# EAGLE design Eggs_Control (EAGLE 6.4)

## Sheet 1 of 2
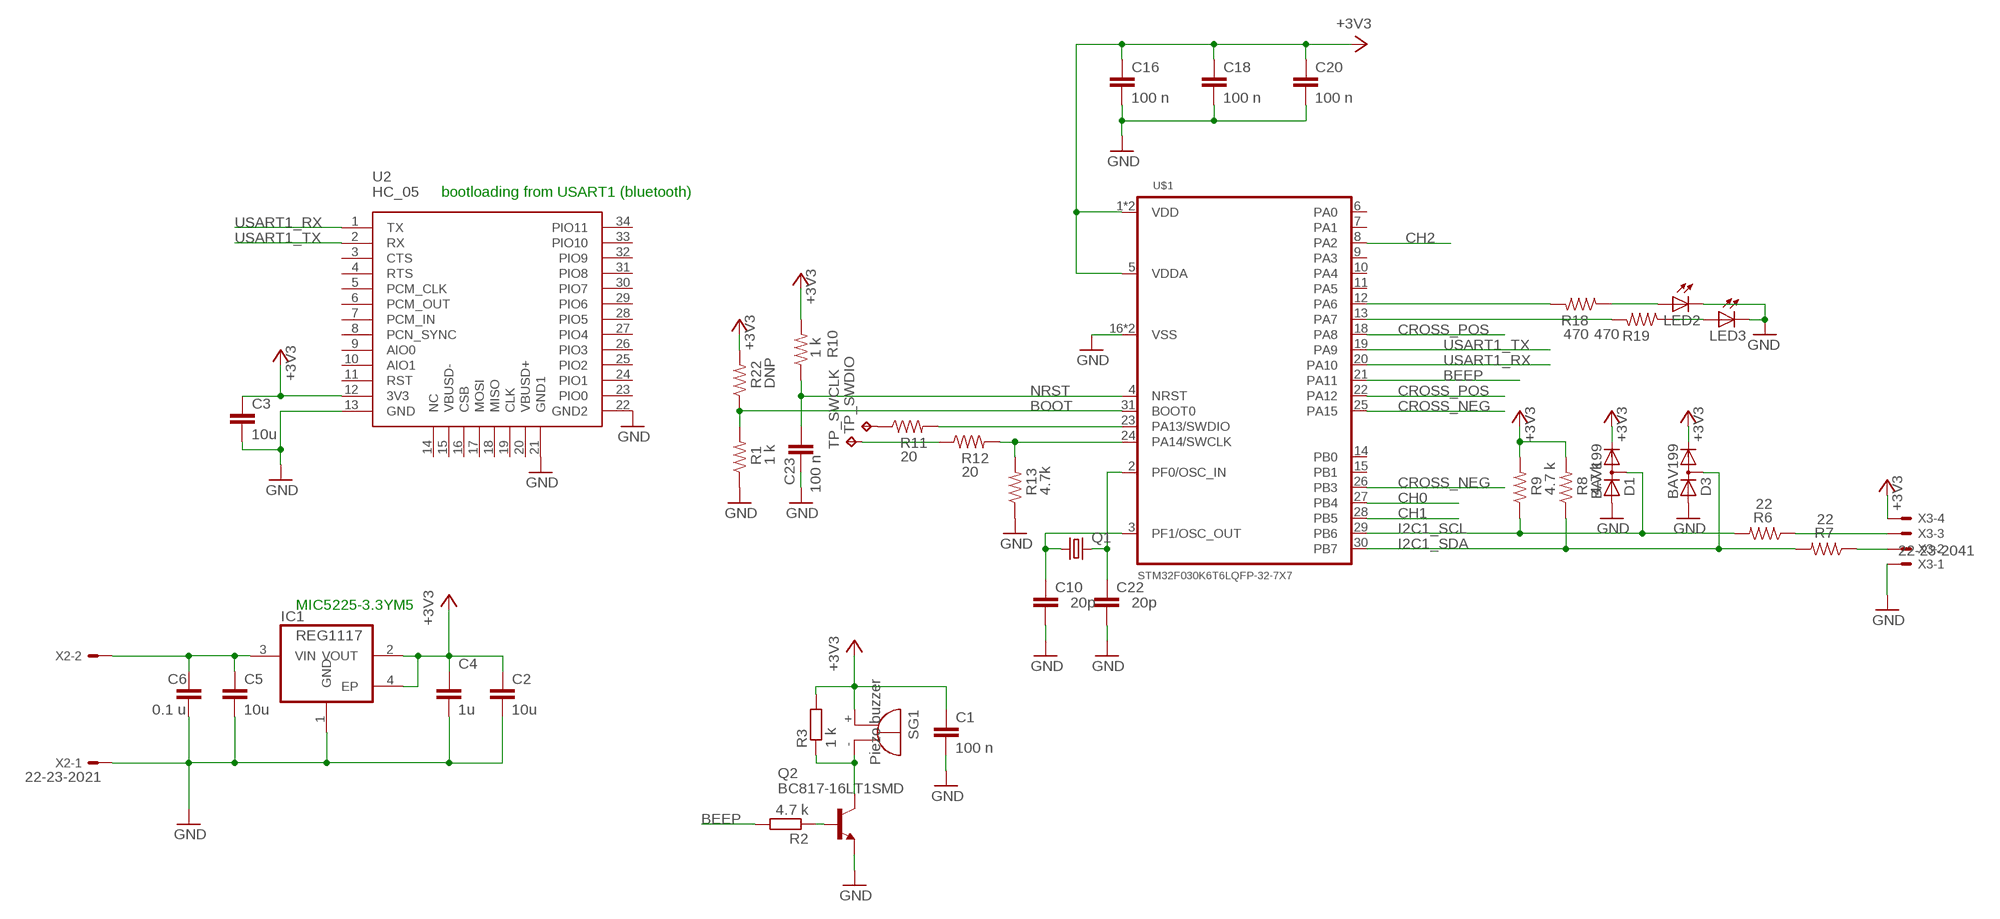
[diagram p0: schematic, sheet 1]

### Parts
C1  100 n  C-EUC0603  [C0603]
C2  10u  C-EUC0805  [C0805]
C3  10u  C-EUC0805  [C0805]
C4  1u  C-EUC0603  [C0603]
C5  10u  C-EUC0805  [C0805]
C6  0.1 u  C-EUC0603  [C0603]
C10  20p  C-EUC0603  [C0603]
C16  100 n  C-EUC0603  [C0603]
C18  100 n  C-EUC0603  [C0603]
C20  100 n  C-EUC0603  [C0603]
C22  20p  C-EUC0603  [C0603]
C23  100 n  C-EUC0603  [C0603]
D1  BAV199  [SOT23]
D3  BAV199  [SOT23]
IC1  REG1117  [SOT223]
LED2  LED_ESML0603  [LED_SML0603]
LED3  LED_ESML0603  [LED_SML0603]
Q1  CRYSTALSM49  [SM49]
Q2  BC817-16LT1SMD  [SOT23-BEC]
R1  1 k  R-US_R0603  [R0603]
R2  4.7 k  R-EU_R0603  [R0603]
R3  1 k  R-EU_R0603  [R0603]
R6  22  R-US_R0603  [R0603]
R7  22  R-US_R0603  [R0603]
R8  4.7 k  R-US_R0603  [R0603]
R9  4.7 k  R-US_R0603  [R0603]
R10  1 k  R-US_R0603  [R0603]
R11  20  R-US_R0603  [R0603]
R12  20  R-US_R0603  [R0603]
R13  4.7k  R-US_R0603  [R0603]
R18  470  R-US_R0603  [R0603]
R19  470  R-US_R0603  [R0603]
R22  DNP  R-US_R0603  [R0603]
SG1  Piezo buzzer  F/HMB  [F/HMB]
TP_SWCLK  TPTP10SQ  [TP10SQ]
TP_SWDIO  TPTP10SQ  [TP10SQ]
U2  HC_05  [BLUETOOTH_SMD]
U$1  STM32F030K6T6LQFP-32-7X7  [LQFP32-7X7]
X2  22-23-2021  [22-23-2021]
X3  22-23-2041  [22-23-2041]

### Nets
+3V3: C1.1 C2.1 C3.1 C4.1 C16.1 C18.1 C20.1 D1.2(C) D3.2(C) IC1.2(VOUT) IC1.4(EP) R3.2 R8.2 R9.2 R10.2 R22.2 SG1.+ U2.12(3V3) U$1.1(VDD) U$1.5(VDDA) U$1.17(VDD) X3.4 ; also sheet 2
BEEP: R2.2 U$1.21(PA11)
BOOT: R1.2 R22.1 U$1.31(BOOT0)
CH0: U$1.27(PB4) ; also sheet 2
CH1: U$1.28(PB5) ; also sheet 2
CH2: U$1.8(PA2) ; also sheet 2
CROSS_NEG: U$1.25(PA15) U$1.26(PB3) ; also sheet 2
CROSS_POS: U$1.18(PA8) U$1.22(PA12) ; also sheet 2
GND: C1.2 C2.2 C3.2 C4.2 C5.2 C6.2 C10.2 C16.2 C18.2 C20.2 C22.2 C23.2 D1.1(A) D3.1(A) IC1.1(GND) LED2.C LED3.C Q2.E R1.1 R13.1 U2.13(GND) U2.21(GND1) U2.22(GND2) U$1.16(VSS) U$1.32(VSS) X2.1 X3.1 ; also sheet 2
I2C1_SCL: D1.3(AC) R6.2 R9.1 U$1.29(PB6)
I2C1_SDA: D3.3(AC) R7.2 R8.1 U$1.30(PB7)
N$2: Q2.B R2.1
N$4: Q2.C R3.1 SG1.-
N$6: R18.2 U$1.12(PA6)
N$8: R19.2 U$1.13(PA7)
N$11: R7.1 X3.2
N$12: R6.1 X3.3
N$17: LED2.A R18.1
N$18: LED3.A R19.1
N$21: R11.2 U$1.23(PA13/SWDIO)
N$22: R12.2 R13.2 U$1.24(PA14/SWCLK)
N$24: R11.1 TP_SWDIO.TP
N$25: R12.1 TP_SWCLK.TP
N$29: C5.1 C6.1 IC1.3(VIN) X2.2
N$34: C22.1 Q1.2 U$1.2(PF0/OSC_IN)
N$35: C10.1 Q1.1 U$1.3(PF1/OSC_OUT)
NRST: C23.1 R10.1 U$1.4(NRST)
USART1_RX: U2.1(TX) U$1.20(PA10)
USART1_TX: U2.2(RX) U$1.19(PA9)
Unconnected: U2.3(CTS) U2.4(RTS) U2.5(PCM_CLK) U2.6(PCM_OUT) U2.7(PCM_IN) U2.8(PCN_SYNC) U2.9(AIO0) U2.10(AIO1) U2.11(RST) U2.14(NC) U2.15(VBUSD-) U2.16(CSB) U2.17(MOSI) U2.18(MISO) U2.19(CLK) U2.20(VBUSD+) U2.23(PIO0) U2.24(PIO1) U2.25(PIO2) U2.26(PIO3) U2.27(PIO4) U2.28(PIO5) U2.29(PIO6) U2.30(PIO7) U2.31(PIO8) U2.32(PIO9) U2.33(PIO10) U2.34(PIO11) U$1.6(PA0) U$1.7(PA1) U$1.9(PA3) U$1.10(PA4) U$1.11(PA5) U$1.14(PB0) U$1.15(PB1)

### Notes on the sheet
- bootloading from USART1 (bluetooth)
- MIC5225-3.3YM5

## Sheet 2 of 2
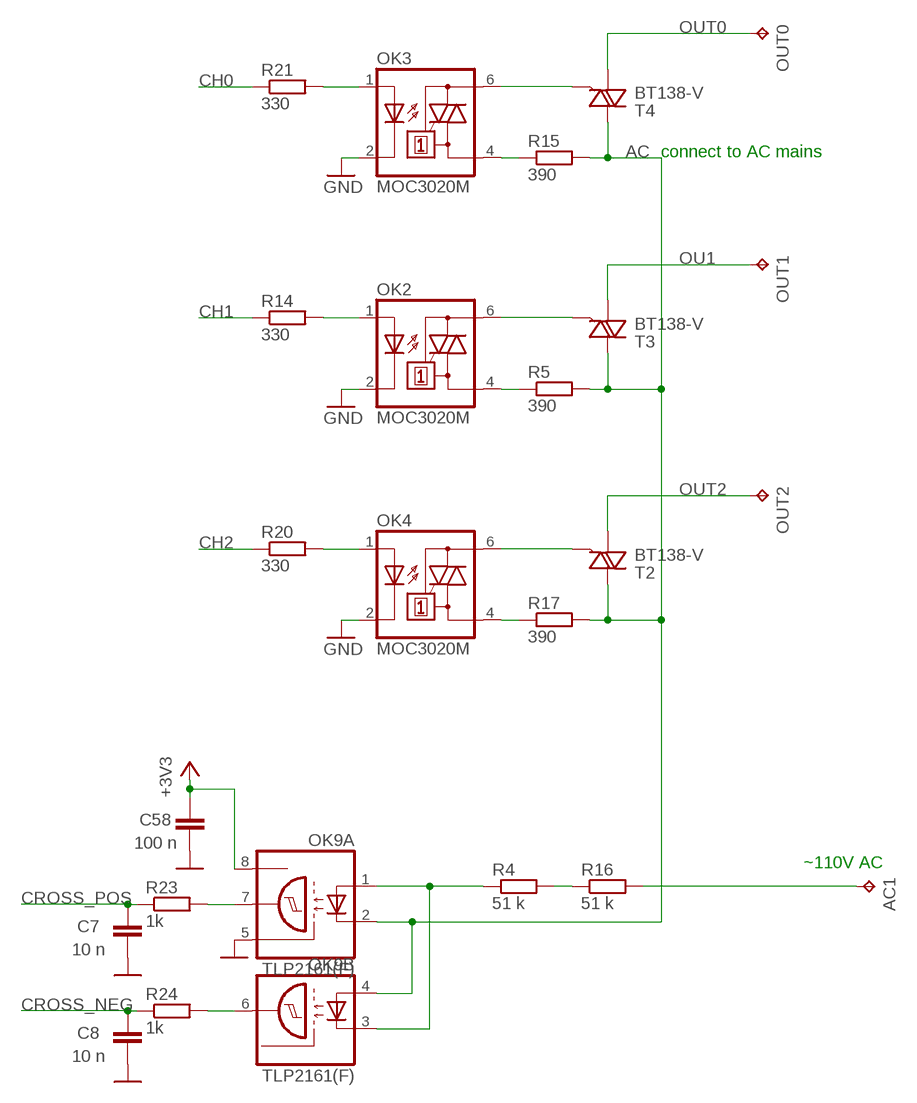
[diagram p1: schematic, sheet 2]

### Parts
AC1  TPPAD1-17  [P1-17]
C7  10 n  C-EUC0603  [C0603]
C8  10 n  C-EUC0603  [C0603]
C58  100 n  C-EUC0603  [C0603]
OK2  MOC3020M  [DIL06]
OK3  MOC3020M  [DIL06]
OK4  MOC3020M  [DIL06]
OK9  TLP2161(F)  [SOIC08-FAIRCHILD]
OUT0  TPPAD1-17  [P1-17]
OUT1  TPPAD1-17  [P1-17]
OUT2  TPPAD1-17  [P1-17]
R4  51 k  R-EU_R1206  [R1206]
R5  390  R-EU_R0603  [R0603]
R14  330  R-EU_R0603  [R0603]
R15  390  R-EU_R0603  [R0603]
R16  51 k  R-EU_R1206  [R1206]
R17  390  R-EU_R0603  [R0603]
R20  330  R-EU_R0603  [R0603]
R21  330  R-EU_R0603  [R0603]
R23  1k  R-EU_R0603  [R0603]
R24  1k  R-EU_R0603  [R0603]
T2  BT138-V  [TO220BV]
T3  BT138-V  [TO220BV]
T4  BT138-V  [TO220BV]

### Nets
+3V3: C58.1 OK9.8(A:VCC) ; also sheet 1
AC: OK9.2(A:C) OK9.4(B:A) R5.2 R15.2 R17.2 T2.T2(A2) T3.T2(A2) T4.T2(A2)
CH0: R21.1 ; also sheet 1
CH1: R14.1 ; also sheet 1
CH2: R20.1 ; also sheet 1
CROSS_NEG: C8.1 R24.1 ; also sheet 1
CROSS_POS: C7.1 R23.1 ; also sheet 1
GND: C7.2 C8.2 C58.2 OK2.2(C) OK3.2(C) OK4.2(C) OK9.5(A:GND) ; also sheet 1
N$1: OK9.1(A:A) OK9.3(B:C) R4.1
N$3: AC1.TP R16.2
N$5: OK9.7(A:OUT) R23.2
N$7: OK9.6(B:OUT) R24.2
N$20: OK2.1(A) R14.2
N$36: R4.2 R16.1
N$37: OK4.1(A) R20.2
N$42: OK4.4(A1) R17.1
N$44: OK4.6(A2) T2.G
N$46: OK2.4(A1) R5.1
N$48: OK2.6(A2) T3.G
N$52: OK3.1(A) R21.2
N$54: OK3.4(A1) R15.1
N$56: OK3.6(A2) T4.G
OU1: OUT1.TP T3.T1(A1)
OUT0: OUT0.TP T4.T1(A1)
OUT2: OUT2.TP T2.T1(A1)

### Notes on the sheet
- connect to AC mains
- ~110V AC

## Library data of the parts
AC1 OUT0 OUT1 OUT2 TP_SWCLK TP_SWDIO = testpad:TP: Test pad
C1-C8 C10 C16 C18 C20 C22 C23 C58 = rcl:C-EU: CAPACITOR, European symbol
D1 D3 = diode:BAV199: DIODE low-leakage double diode
IC1 = burr-brown:REG1117: 800mA and 1A Low Dropout (LDO) Positive Regulator 1.8V, 2.5V, 2.85V, 3.3V, 5V, and Adj; MPN: REG1117; OC_FARNELL: 1097566; OC_NEWARK: 14P6981
LED2 LED3 = eagle-ltspice:LED_E: LED Source: http://www.osram.convergy.de Source: www.luxeon.com Source: www.kingbright.com; SPICEMODEL: NONE; SPICEPREFIX: D; SPICETYPE: diode
OK2-OK4 = optocoupler:MOC30*M: RANDOM-PHASE OPTOISOLATORS TRIAC DRIVER OUTPUT Source: http://www.fairchildsemi.com MOC3020-M.pdf; MF: FAIRCHILD SEMICONDUCTOR; MPN: MOC3020-M; OC_FARNELL: 1505425; OC_NEWARK: 72K8895
OK9 = optocoupler:TLP2161(F)
Q1 = adafruit:CRYSTAL: CRYSTAL; OC_FARNELL: unknown; OC_NEWARK: unknown
Q2 = transistor-npn:BC817*: NPN Transistor
R1 R6-R13 R18 R19 R22 = resistor:R-US_: RESISTOR, American symbol
R2-R4 R16 = resistor:R-EU_: RESISTOR, European symbol
R5 R14 R15 R17 R20 R21 R23 R24 = rcl:R-EU_: RESISTOR, European symbol
SG1 = buzzer:F/HMB: BUZZER Source: Buerklin; OC_FARNELL: unknown; OC_NEWARK: unknown
T2-T4 = triac:BT138: TRIAC Source: http://www.semiconductors.philips.com BT138_SERIES_2.pdf
U2 = Bluetooth HC-05:HC_05: HC-05 Bluetooth Module
U$1 = STM32F030K6T6:STM32F030K6T6
X2 = con-molex:22-23-2021: .100" (2.54mm) Center Header - 2 Pin; MF: MOLEX; MPN: 22-23-2021; OC_FARNELL: 1462926; OC_NEWARK: 25C3832
X3 = con-molex:22-23-2041: .100" (2.54mm) Center Header - 4 Pin; MF: MOLEX; MPN: 22-23-2041; OC_FARNELL: 1462920; OC_NEWARK: 38C0355

## Net classes
1 PWR: width 0.203 mm, drill 0.4 mm, clearance 0.076 mm

## Board
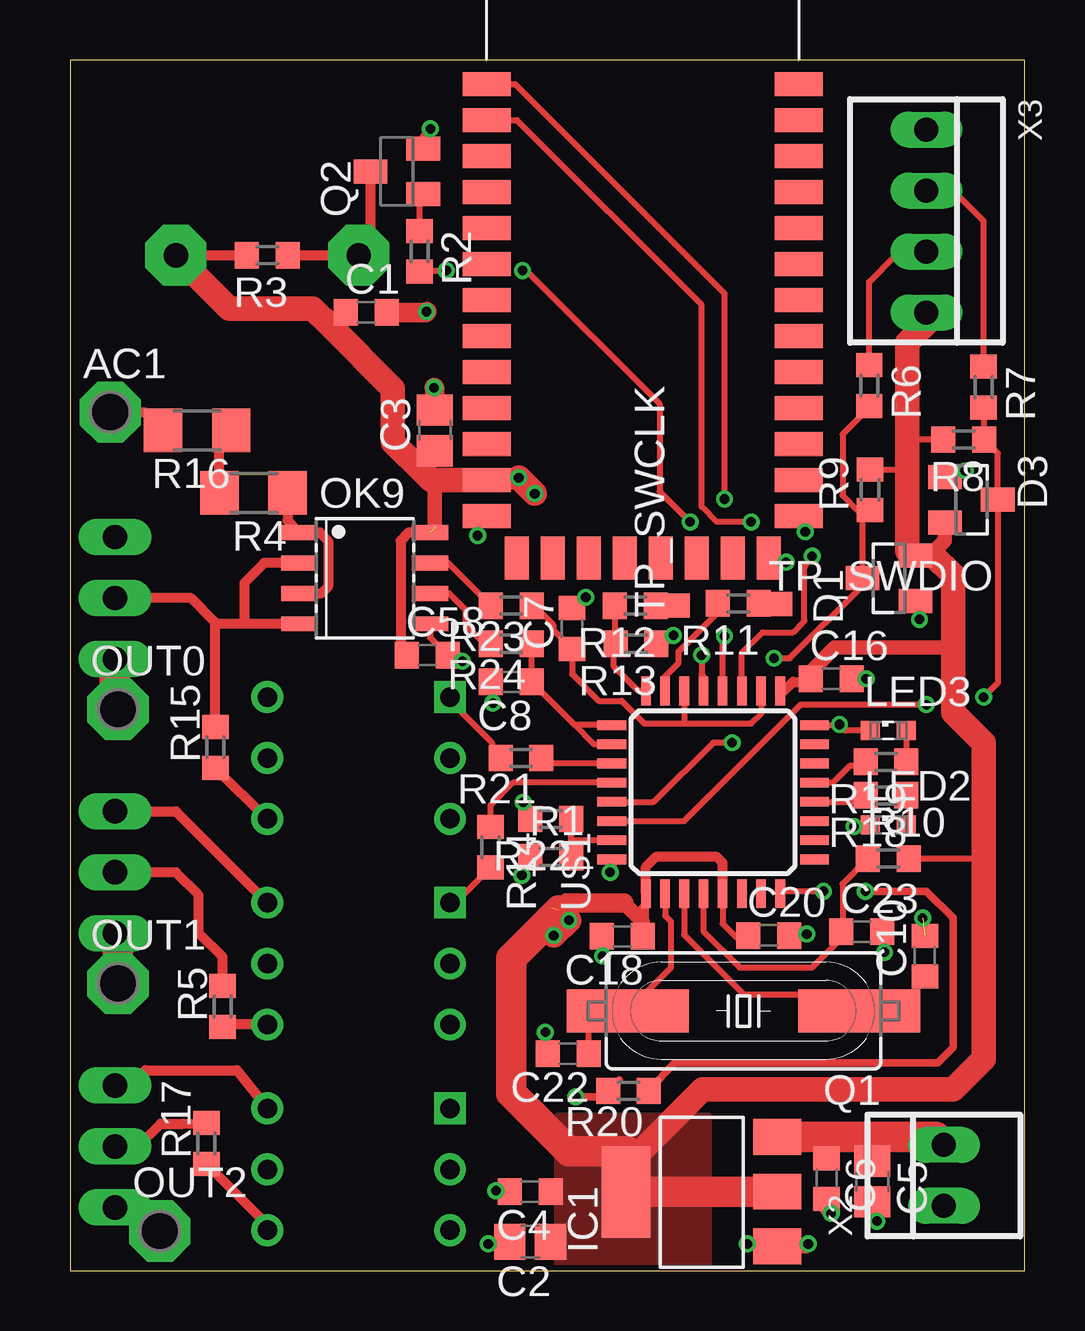
[diagram p2: board, top side]
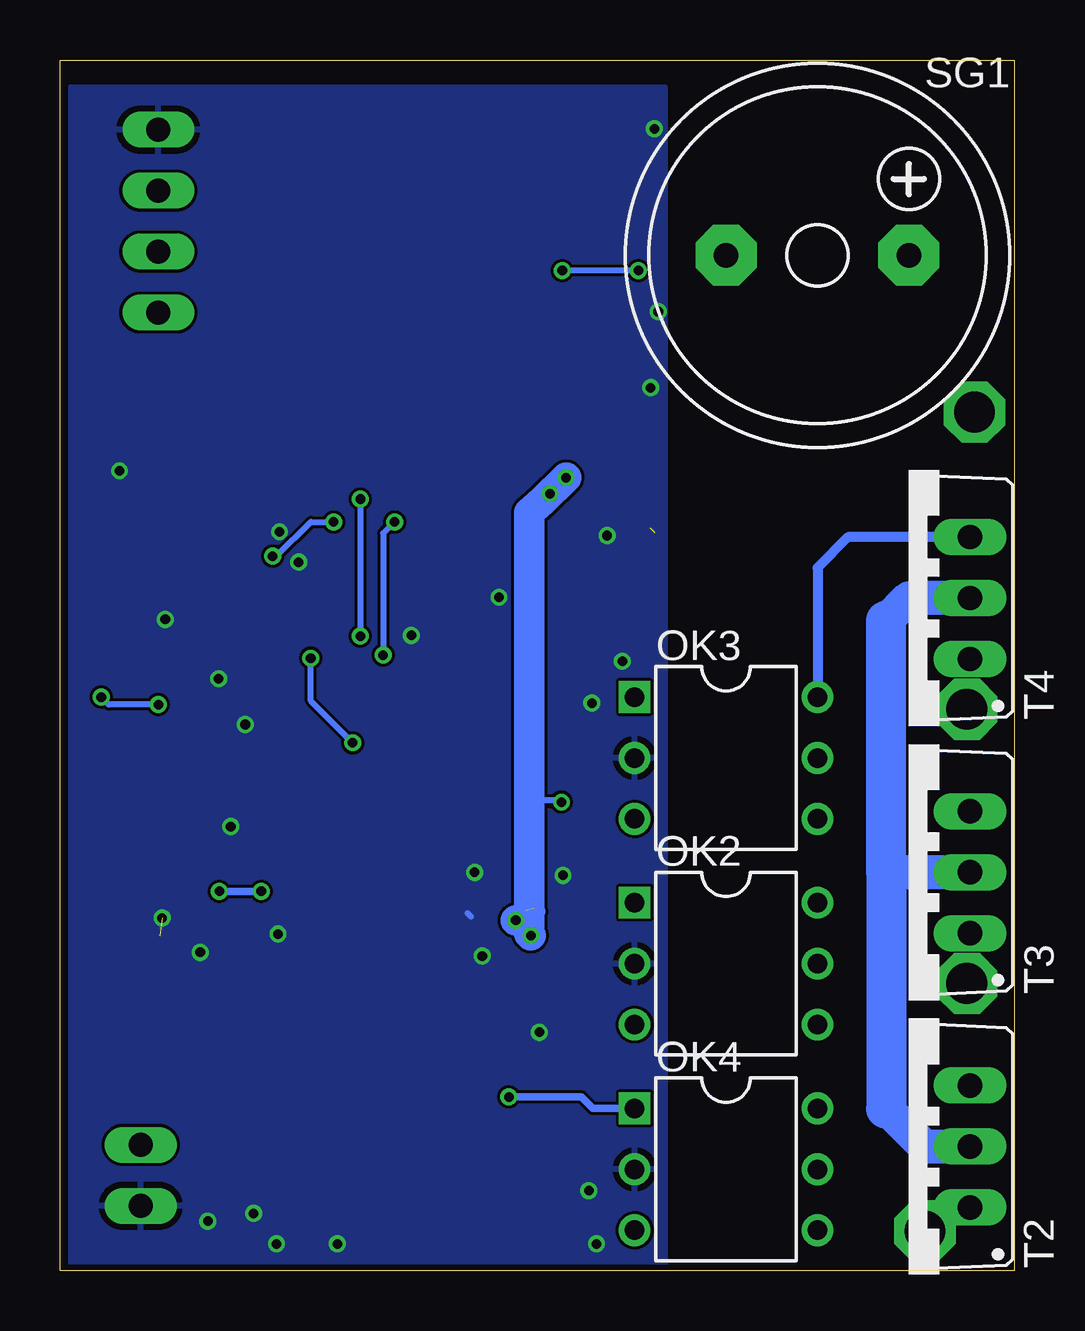
[diagram p3: board, bottom side, seen from below]

Size 39.77 x 50.48 mm. Coordinates in mm from the lower left corner, seen from the top.
Outline: 0,0 39.77,0 39.77,50.48 0,50.48 0,0
Copper layers (1*16): Top 0.035mm / dielectric 1.5mm / Bottom 0.035mm
Design rules "dirt_cheap_dirty_boards.v1": minimum track width 5mil, minimum drill 12mil, track to track 5mil, track to pad 5mil, pad to pad 5mil, via to via 5mil, smd to smd 0mil, copper to edge 10mil, drill to drill 10mil, minimum pad ring 10mil, minimum via ring 6mil, stop-mask expansion 2mil, vias tented up to drill 25mil, thermal gap 10mil

### Footprints (pad centres in the part's own frame; a part is rotated, then mirrored left to right if it is on the bottom)
P1-17 = drill 1.702 pad 2.54 octagon: TP 0,0
C0603 = smd 1 x 1.1: 1 -0.85,0; 2 0.85,0
C0805 = smd 1.3 x 1.5: 1 -0.85,0; 2 0.85,0
SOT23 = smd 1 x 1.4: 1 -0.95,-1.1; 2 0.95,-1.1; 3 0,1.1
SOT223 = smd 1.499 x 2.007: 1 -2.261,-3.15; 2 0.025,-3.15; 3 2.311,-3.15 | smd 3.81 x 2.007: 4 0,3.15
LED_SML0603 = smd 0.8 x 0.8: A 0.75,0; C -0.75,0
DIL06 = drill 0.813 square: 1 -2.54,-3.81 | drill 0.813: 2 0,-3.81; 3 2.54,-3.81; 4 2.54,3.81; 5 0,3.81; 6 -2.54,3.81
SOIC08-FAIRCHILD = smd 0.61 x 1.52: 1 -1.905,-2.723; 2 -0.635,-2.723; 3 0.635,-2.723; 4 1.905,-2.723; 5 1.905,2.723; 6 0.635,2.723; 7 -0.635,2.723; 8 -1.905,2.723
SM49 = smd 5.08 x 1.778: 1 -4.826,0; 2 4.826,0
SOT23-BEC = smd 1 x 1.4: B -0.95,-1.1; C 0,1.1; E 0.95,-1.1
R0603 = smd 1 x 1.1: 1 -0.85,0; 2 0.85,0
R1206 = smd 1.6 x 1.803: 1 -1.422,0; 2 1.422,0
F/HMB = drill 1.016 pad 2.54 octagon: + 3.81,0; - -3.81,0
TO220BV = drill 1.016 long: G 2.54,-2.54; T1 -2.54,-2.54; T2 0,-2.54
TP10SQ = smd 1 x 1: TP 0,0
BLUETOOTH_SMD = smd 2 x 1: 1 -6.35,3.81; 2 -6.35,2.31; 3 -6.35,0.81; 4 -6.35,-0.69; 5 -6.35,-2.19; 6 -6.35,-3.69; 7 -6.35,-5.19; 8 -6.35,-6.69; 9 -6.35,-8.19; 10 -6.35,-9.69; 11 -6.35,-11.19; 12 -6.35,-12.69; 13 -6.35,-14.19; 22 6.65,-14.19; 23 6.65,-12.69; 24 6.65,-11.19; 25 6.65,-9.69; 26 6.65,-8.19; 27 6.65,-6.69; 28 6.65,-5.19; 29 6.65,-3.69; 30 6.65,-2.19; 31 6.65,-0.69; 32 6.65,0.81; 33 6.65,2.31; 34 6.65,3.81 | smd 1 x 1.8: 14 -5.1,-15.94; 15 -3.6,-15.94; 16 -2.1,-15.94; 17 -0.6,-15.94; 18 0.9,-15.94; 19 2.4,-15.94; 20 3.9,-15.94; 21 5.4,-15.94
LQFP32-7X7 = smd 1.2 x 0.4: 1 -4.225,2.8; 2 -4.225,2; 3 -4.225,1.2; 4 -4.225,0.4; 5 -4.225,-0.4; 6 -4.225,-1.2; 7 -4.225,-2; 8 -4.225,-2.8; 17 4.225,-2.8; 18 4.225,-2; 19 4.225,-1.2; 20 4.225,-0.4; 21 4.225,0.4; 22 4.225,1.2; 23 4.225,2; 24 4.225,2.8 | smd 0.4 x 1.2: 9 -2.8,-4.225; 10 -2,-4.225; 11 -1.2,-4.225; 12 -0.4,-4.225; 13 0.4,-4.225; 14 1.2,-4.225; 15 2,-4.225; 16 2.8,-4.225; 25 2.8,4.225; 26 2,4.225; 27 1.2,4.225; 28 0.4,4.225; 29 -0.4,4.225; 30 -1.2,4.225; 31 -2,4.225; 32 -2.8,4.225
22-23-2021 = drill 1 long: 1 -1.27,0; 2 1.27,0
22-23-2041 = drill 1 long: 1 -3.81,0; 2 -1.27,0; 3 1.27,0; 4 3.81,0

### Placement (x,y rotation side)
AC1  1.67,35.79 0 top
C1  12.34,39.95 0 top
C2  19.16,1.22 180 top
C3  15.19,35.03 90 top
C4  19.16,3.31 180 top
C5  33.42,3.73 270 top
C6  31.51,3.85 270 top
C7  20.91,26.78 90 top
C8  18.37,24.55 180 top
C10  35.61,13.12 90 top
C16  31.7,24.68 0 top
C18  23,13.95 180 top
C20  29.1,13.98 0 top
C22  20.75,9.06 180 top
C23  32.97,14.14 0 top
C58  14.88,25.67 0 top
D1  34.12,28.87 90 top
D3  37.54,32.14 270 top
IC1  26.3,3.28 90 top
LED2  34.08,18.59 0 top
LED3  34.08,22.52 0 top
OK2  12.02,12.81 270 bottom
OK3  12.02,21.38 270 bottom
OK4  12.02,4.23 270 bottom
OK9  12.27,28.87 270 top
OUT0  1.98,23.41 0 top
OUT1  1.98,11.98 0 top
OUT2  3.73,1.66 0 top
Q1  28.05,10.84 180 top
Q2  13.61,45.83 90 top
R1  20.02,17.25 0 top
R2  14.56,42.49 270 top
R3  8.21,42.34 180 top
R4  7.64,32.43 180 top
R5  6.34,11.03 90 top
R6  33.29,36.91 270 top
R7  38.05,36.84 270 top
R8  37.23,34.65 180 top
R9  33.32,32.56 90 top
R10  34.08,17.19 0 top
R11  27.83,27.83 180 top
R12  23.54,27.73 180 top
R13  23.57,26.14 180 top
R14  17.51,17.67 270 top
R15  6.05,21.82 90 top
R16  5.29,35.03 180 top
R17  5.67,5.31 90 top
R18  33.99,19.82 180 top
R19  33.99,21.22 180 top
R20  23.26,7.51 180 top
R21  18.78,21.38 180 top
R22  20.02,18.84 180 top
R23  18.37,27.73 180 top
R24  18.37,26.14 180 top
SG1  8.21,42.34 0 bottom
T2  4.4,5.19 90 bottom
T3  4.4,16.62 90 bottom
T4  4.4,28.05 90 bottom
TP_SWCLK  25.32,27.73 90 top
TP_SWDIO  29.58,27.79 0 top
U2  23.7,45.66 0 top
U$1  26.78,19.95 90 top
X2  36.4,3.98 90 top
X3  35.67,43.76 270 top

### Tracks (layer width: path | path; a pad name or v marks a point on that pad's centre or on a via)
+3V3  (via drill 0.4)  (2 unrouted)
  Top 0.254: 13.76,25.93 C58.1 | C1.1 11.38,39.95 10.83,39.4 | 15.19,34.08 15.19,33.6 14.8,33.21 | R8.2 34.94,34.65 34.88,34.71 | R9.2 34.68,33.41 34.88,33.6 | R22.2 19.17,19.25 v18.88,19.54 | U$1.1 23.98,14.08 C18.1 | U$1.5 27.18,14.47 27.73,13.92 28.34,13.92 C20.1 | R10.2 37.99,17.19 38.05,17.25
  Top 0.305: 37.99,16.71 38.05,16.78
  Top 0.406: SG1.+ R3.2 | 18.59,32.97 v18.69,33.06 | OK9.8 14.11,30.78 13.76,30.43 13.76,25.93 | U$1.17 29.74,24.18 30.11,24.55 30.73,24.55 C16.1 | U$1.1 23.98,16.83 24.4,17.25 26.94,17.25 27.18,17.01 U$1.5 | C18.1 23.85,14.55 23.85,15.1
  Top 0.61: 15.19,32.97 15.19,30.98 | 7.41,42.28 R3.2 | D3.2 36.44,30.44 35.83,29.82 | C16.1 30.85,24.98 31.86,25.98 36.78,25.98 | 23.06,15.35 23.85,14.55 | 20.69,15.35 20.37,15.03
  Top 0.813: 15.14,34.24 C3.1 15.19,34.08 | U2.12 18.59,32.97 | X3.4 35.67,39.48 | 34.88,30 D1.2 35.83,29.82 35.96,29.82 | 23.06,15.35 20.69,15.35
  Top 1.016: U2.12 15.19,32.97 15.03,32.97 14.8,33.21 13.45,34.56 13.45,36.78 10.83,39.4 10.11,40.11 6.62,40.11 SG1.+ | C3.1 | v18.69,33.06 v19.35,32.4 | v20.15,13.98 v20.78,14.62 | 23.18,4.39 26.36,7.57 36.78,7.57 38.05,8.84 38.05,16.78 38.05,17.25 38.05,22.02 36.78,23.29 36.78,25.98 36.78,29 35.96,29.82 | 35.67,39.48 34.88,38.68 34.88,34.71 34.88,33.6 34.88,30
  Top 1.27: IC1.2 23.18,3.31 | 23.18,3.31 IC1.4 | 23.18,3.31 23.18,4.39 23.18,4.98 20.8,4.98 18.37,7.41 18.37,13.03 20.37,15.03
  Bottom 0.254: 20.11,17.32 20.21,17.41 | 20.27,26.24 20.21,26.3 | 20.21,19 20.15,19.06 20.15,19.13 19.64,19.63 18.97,19.63 v18.88,19.54
  Bottom 0.305: 19.84,14.98 20,15.14
  Bottom 0.61: 20.27,14.62 20.21,14.62 19.84,14.98
  Bottom 1.27: 20.21,14.55 20.21,17.41 20.21,19 20.21,26.3 20.21,31.6 19.67,32.08 v18.69,33.06 | 20.21,14.55 20.21,14.05 v20.15,13.98 | v20.78,14.62 20.27,14.62 20.21,14.55
  pour Top (no thermals): 20.27,6.46 20.27,0.27 26.62,0.27 26.62,6.3 26.62,6.46 20.43,6.46
AC
  Top 0.406: T2.T2 2.81,5.19 3.76,6.14 4.69,6.14 R17.2 | R5.2 6.34,13.08 5.35,14.08 5.35,15.66 4.4,16.62 T3.T2 | OK9.4 7.26,26.97 | T4.T2 5.03,28.05 6.05,27.03 | OK9.2 8.08,29.51 7.26,28.68 7.26,26.97 | R15.2 6.05,27.03 | 7.26,26.97 6.11,26.97 6.05,27.03
  Bottom 1.422: T3.T2 5.35,16.62 | 5.35,6.77 3.76,5.19 T2.T2 | T4.T2 4.4,28.05 5.35,27.09
  Bottom 1.676: 5.35,6.77 5.35,16.62 5.35,27.09
BEEP  (via drill 0.4)
  Top 0.254: v18.84,41.7 19,41.7 24.56,36.14 24.56,32.49 v25.83,31.22 | v15.67,41.7 14.56,41.7 R2.2 | v26.3,25.67 26.3,24.87 26.38,24.8 U$1.21
  Bottom 0.254: v15.67,41.7 v18.84,41.7 | v26.3,25.67 26.3,30.75 v25.83,31.22
BOOT
  Top 0.254: R1.2 20.87,17.89 | 20.87,17.89 R22.1 | U$1.31 20.93,17.95 20.87,17.89
CH0
  Top 0.254: U$1.27 19.86,21.15 R21.1
CH1
  Top 0.254: R14.1 17.51,19.41 18.45,20.35 U$1.28
CH2  (via drill 0.4)
  Top 0.254: v31.39,15.82 29.68,15.82 U$1.8
  Top 0.305: R20.1 24.97,8.46 25.19,8.68 36.15,8.68 36.78,9.31 36.78,14.71 35.67,15.82 v33.13,15.82
  Bottom 0.305: v31.39,15.82 v33.13,15.82
CROSS_NEG
  Top 0.254: C8.1 R24.1 | C8.1 19.22,24.5 | U$1.25 21.02,22.75 | 21.02,22.75 C8.1 | U$1.26 21.82,21.95 21.02,22.75
CROSS_POS
  Top 0.254: R23.1 19.32,27.73 20.11,26.94 20.11,26.72 C7.1 20.91,24.87 22.02,23.76 22.97,23.76 23.92,22.81 25.51,22.81 | 25.51,22.81 28.37,22.81 28.78,23.22 U$1.18 | U$1.22 25.58,22.88 25.51,22.81
GND  (via drill 0.4)  (1 unrouted)
  Top 0.254: Q2.E 14.71,47.31 v15,47.61 | U2.13 17,31.47 v16.97,30.65 | U2.21 29.65,29.72 v29.83,29.54 | U2.22 30.35,31.08 v30.62,30.81 | C4.2 18.18,3.31 v17.73,3.35 | C2.2 18.15,1.22 v17.41,1.12 | D1.1 35.36,27.92 v35.39,27.16 | OK9.5 14.99,26.4 C58.2 16.24,25.67 v16.34,25.41 | C8.2 17.52,24.23 v17.61,23.67 | C7.2 21.03,27.63 v21.48,28.08 | D3.1 37.03,33.09 v37.29,33.35 | C16.2 v33.16,24.68 | v18.81,16.49 18.81,17.21 R1.1 | R13.1 24.78,26.14 v25.13,26.49 | U$1.16 31.71,22.75 v32.05,22.78 32.31,22.52 LED3.C | v32.66,18.52 33.27,18.52 LED2.C | v19.8,9.95 19.8,9.16 C22.2 | C18.2 22.15,13.15 v22.18,13.12 | C20.2 30.62,13.98 v30.69,14.05
  Top 0.406: U$1.32 22.56,16.68 v22.49,16.62 | v33.93,13.28 33.93,14.04 C23.2
  Top 0.61: C6.2 31.51,2.58 v31.7,2.39 | C5.2 33.42,2.27 v33.61,2.08 | IC1.1 30.65,1.02 v30.75,1.12
  Top 0.813: C1.2 14.81,39.95 v14.84,39.99 | C3.2 15.19,36.78 v15.16,36.81
  Bottom 0.254: 22.65,14.77 22.79,14.9
  other vias: 28.21,1.12 35.51,14.71
  pour Bottom: 14.56,49.32 39.32,49.32 39.32,-0.21 14.56,-0.21
I2C1_SCL  (via drill 0.4)
  Top 0.254: R6.2 32.88,35.58 32.18,34.87 32.18,32.33 32.81,31.7 R9.1 33.02,31.4 D1.3 32.81,28.67 32.81,28.37 29.99,25.54 v29.32,25.54 | v27.57,22.02 26.78,22.02 24.32,19.55 U$1.29
  Bottom 0.254: v27.57,22.02 29.32,23.76 v29.32,25.54
I2C1_SDA  (via drill 0.4)
  Top 0.254: R7.2 38.05,34.68 R8.1 38.64,34.08 D3.3 38.64,24.51 v38.05,23.92 | U$1.30 25.58,18.75 30.43,23.6 v35.67,23.6
  Bottom 0.254: v35.67,23.6 37.73,23.6 v38.05,23.92
N$1
  Top 0.406: R4.1 9.06,31.27 OK9.1 10.4,30.78 10.75,30.43 10.75,28.52 10.46,28.24 OK9.3
N$2
  Top 0.254: R2.1 14.56,44.73 Q2.B
N$3
  Top 0.406: AC1.TP 3.1,35.8 R16.2
N$4
  Top 0.406: R3.1 SG1.- 12.5,42.82 Q2.C
N$5
  Top 0.254: OK9.7 15.74,29.51 R23.2
N$6
  Top 0.254: U$1.12 32.87,19.55 R18.2
N$7
  Top 0.254: OK9.6 15.8,28.24 16.46,27.57 16.46,26.94 17.1,26.3 17.36,26.3 R24.2
N$8
  Top 0.254: U$1.13 31.79,20.35 32.5,21.06 32.98,21.06 R19.2
N$11
  Top 0.254: R7.1 38.05,43.76 36.94,44.88 35.83,44.88 X3.2
N$12
  Top 0.254: R6.1 33.29,41.22 34.4,42.34 35.51,42.34 X3.3
N$17
  Top 0.254: LED2.A 35.02,18.71 35.02,19.65 R18.1
N$18
  Top 0.254: LED3.A R19.1
N$20
  Top 0.254: OK2.1 16.04,15.35 R14.2
N$21
  Top 0.254: R11.2 26.98,27.45 25.35,25.82 25.35,25.35 24.72,24.71 24.72,24.24 U$1.23
N$22
  Top 0.254: R12.2 22.69,26.17 R13.2 22.65,26.07 22.65,25.19 23.67,24.18 U$1.24
N$24
  Top 0.254: R11.1 29.54,27.82 TP_SWDIO.TP
N$25
  Top 0.254: R12.1 TP_SWCLK.TP
N$29
  Top 0.61: C6.1 31.51,5.47 31.39,5.59 | C5.1 33.42,5.47 33.29,5.59
  Top 1.27: IC1.3 31.39,5.59 33.29,5.59 36.06,5.59 X2.2
N$34
  Top 0.254: U$1.2 24.78,14.81 25.04,14.55 25.04,12.65 Q1.2 23.13,10.74 21.7,10.74 21.6,10.64 C22.1
N$35
  Top 0.254: Q1.1 32.4,11.64 | U$1.3 25.58,14.01 28.05,11.54 32.18,11.54 Q1.1 | C10.1 35.61,12.11 34.24,10.74 32.97,10.74 Q1.1
N$36
  Top 0.406: R4.2 6.21,34.54 R16.1
N$37  (via drill 0.4)
  Top 0.305: R20.2 22.88,7.96 22.18,7.25 v21.07,7.25
  Bottom 0.305: v21.07,7.25 18.05,7.25 17.57,6.77 OK4.1
N$42
  Top 0.406: OK4.4 8.12,2.01 R17.1
N$44
  Top 0.406: T2.G 2.49,7.73 3.13,8.36 6.94,8.36 OK4.6
N$46
  Top 0.406: OK2.4 6.43,10.27 R5.1
N$48
  Top 0.406: T3.G 4.4,19.16 OK2.6
N$52
  Top 0.254: OK3.1 16.03,23.92 16.03,23.56 17.57,22.02 17.57,21.74 R21.2
N$54
  Top 0.406: OK3.4 8.21,18.82 R15.1
N$56
  Bottom 0.406: T4.G 6.94,30.59 8.21,29.32 OK3.6
NRST
  Top 0.254: U$1.4 26.38,14.16 27.89,12.65 30.91,12.65 32.12,13.86 C23.1 32.18,14.2 32.18,16.13 R10.1
OU1
  Top 1.27: OUT1.TP 1.98,13.95 T3.T1
OUT0
  Top 1.27: T4.T1 1.86,23.54 OUT0.TP
OUT2
  Top 1.27: T2.T1 2.75,2.65 OUT2.TP
USART1_RX  (via drill 0.4)
  Top 0.254: U2.1 18.54,49.47 27.26,40.75 v27.26,32.17 | U$1.20 27.18,26.38 v27.26,26.46
  Bottom 0.254: v27.26,32.17 v27.26,26.46
USART1_TX  (via drill 0.4)
  Top 0.254: U2.2 18.61,47.97 26.3,40.27 26.3,31.86 26.94,31.22 v28.37,31.22 | v30.91,29.79 30.59,29.32 30.59,27.09 30.11,26.62 28.84,26.62 27.98,25.75 U$1.19
  Bottom 0.254: v30.91,29.79 30.75,29.79 29.32,31.22 v28.37,31.22

### Text on the board
tOrigins: *